# EAGLE design SMD_Latch_Switch_v01 (EAGLE 6.5.0)
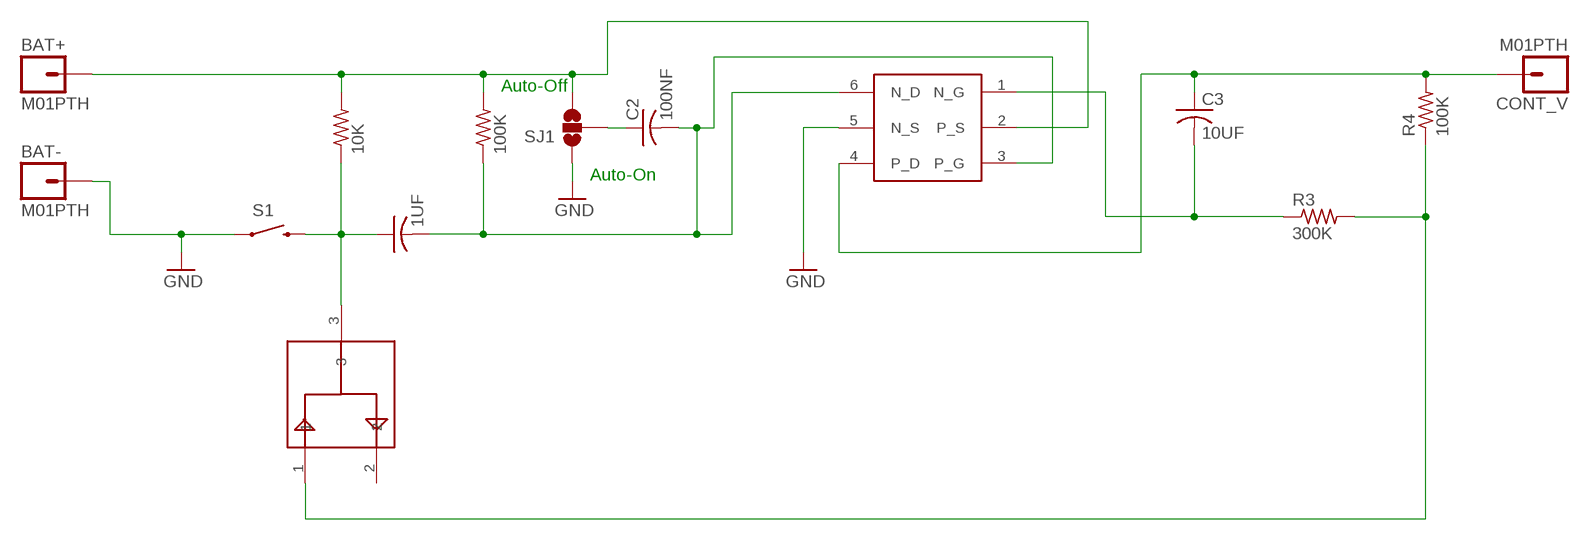
[diagram p0: schematic, sheet 1]

## Parts
1UF  1UF  C-USC0402  [C0402]
10K  10K  R-US_R0402  [R0402]
100K  100K  R-US_R0402  [R0402]
BAT+  M01PTH  [1X01]
BAT-  M01PTH  [1X01]
C2  100NF  C-USC0402  [C0402]
C3  10UF  C-USC0805  [C0805]
CONT_V  M01PTH  [1X01]
R3  300K  R-US_R0402  [R0402]
R4  100K  R-US_R0402  [R0402]
S1  SWITCH-MOMENTARY-2SMD  [TACTILE_SWITCH_SMD]
SJ1  SOLDERJUMPER_2WAYPASTE1&2  [SJ_3_PASTE1&2]
U$1  SI3588DV  [SOT23-6]
U$2  BAV99  [SOT23]

## Nets
GND: BAT-.1 S1.1 SJ1.1 U$1.5(N_S)
N$1: 10K.2 100K.2 BAT+.1 SJ1.3 U$1.2(P_S)
N$2: 1UF.1 10K.1 S1.3 U$2.3
N$3: C2.1 SJ1.2
N$4: 1UF.2 100K.1 C2.2 U$1.3(P_G) U$1.6(N_D)
N$5: R3.2 R4.1 U$2.1
N$6: C3.1 CONT_V.1 R4.2 U$1.4(P_D)
N$7: C3.2 R3.1 U$1.1(N_G)
Unconnected: U$2.2

## Notes on the sheet
- Auto-Off
- Auto-On

## Library data of the parts
1UF C2 C3 = resistor:C-US: CAPACITOR, American symbol
10K 100K R3 R4 = resistor:R-US_: RESISTOR, American symbol
BAT+ BAT- CONT_V = SparkFun-Connectors:M01: Header 1 Standard 1-pin 0.1" header. Use with straight break away headers (SKU : PRT-00116), right angle break away headers (PRT-00553), swiss pins (PRT-00743), machine pins (PRT-00117), and female headers (PRT-00115).
S1 = SparkFun-Electromechanical:SWITCH-MOMENTARY-2: Various NO switches- pushbuttons, reed, etc
SJ1 = SparkFun-Passives:SOLDERJUMPER_2WAY: Solder Jumper 2 way solder jumper
U$1 = adafruit:SI3588DV
U$2 = adafruit:BAV99

## Board
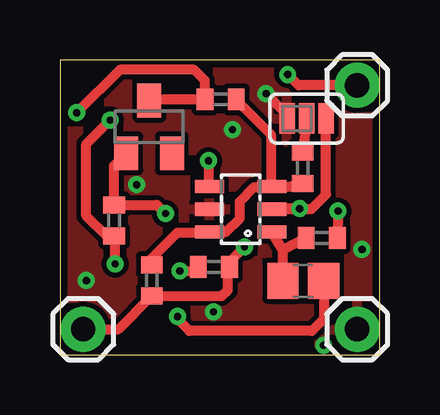
[diagram p1: board, top side]
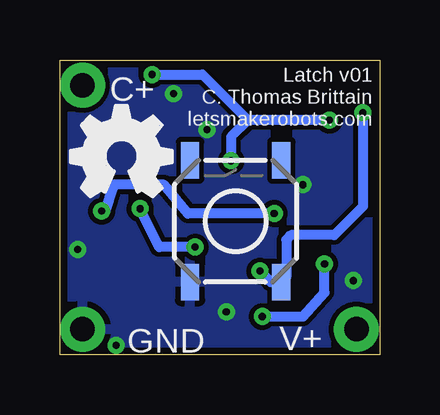
[diagram p2: board, bottom side, seen from below]

Size 13.34 x 12.29 mm. Coordinates in mm from the lower left corner, seen from the top.
Outline: 0,0 13.34,0 13.34,12.29 0,12.29 0,0
Copper layers (1*16): Top 0.035mm / dielectric 1.5mm / Bottom 0.035mm
Design rules "default *": minimum track width 10mil, minimum drill 24mil, track to track 8mil, track to pad 8mil, pad to pad 8mil, via to via 8mil, smd to smd 8mil, copper to edge 12mil, drill to drill 6mil, minimum pad ring 10mil, minimum via ring 8mil, stop-mask expansion 4mil, vias tented up to drill 0mil, thermal gap 10mil

### Footprints (pad centres in the part's own frame; a part is rotated, then mirrored left to right if it is on the bottom)
C0402 = smd 0.7 x 0.9: 1 -0.65,0; 2 0.65,0
R0402 = smd 0.7 x 0.9: 1 -0.65,0; 2 0.65,0
1X01 = drill 1.016 pad 1.88: 1 0,0
C0805 = smd 1.3 x 1.5: 1 -0.85,0; 2 0.85,0
TACTILE_SWITCH_SMD = smd 1.524 x 0.762: 1 -2.54,1.905; 2 2.54,1.905; 3 -2.54,-1.905; 4 2.54,-1.905
SJ_3_PASTE1&2 = smd 0.635 x 1.27: 1 -0.813,0; 2 0,0; 3 0.813,0
SOT23-6 = smd 0.55 x 1.2: 1 -0.95,-1.3; 2 0,-1.3; 3 0.95,-1.3; 4 0.95,1.3; 5 0,1.3; 6 -0.95,1.3
SOT23 = smd 1 x 1.4: 1 -0.95,-1.1; 2 0.95,-1.1; 3 0,1.1

### Placement (x,y rotation side)
1UF  6.7,10.66 0 top
10K  6.42,3.67 0 top
100K  3.83,3.11 270 top
BAT+  0.97,1.07 0 top
BAT-  12.4,1.07 0 top
C2  10.13,7.8 270 top
C3  10.15,3.09 180 top
CONT_V  12.4,11.25 0 top
R3  10.92,4.88 0 top
R4  2.26,5.61 270 top
S1  6.01,5.58 90 bottom
SJ1  10.29,9.86 0 top
U$1  7.54,6.08 90 top
U$2  3.72,9.51 0 top
U$3  [OSHW_FILLX150_NOTEXT]  12.9,6.6 0 bottom

### Tracks (layer width: path | path; a pad name or v marks a point on that pad's centre or on a via)
GND  (via drill 0.3)
  Top 0.406: SJ1.1 9.48,10.02 v8.6,10.9
  other vias: 7.2,9.4 6.4,1.8 1.1,3.1 11,0.4 12.6,4.4 3.2,7.1
  pour Bottom: -1.57,-0.2 -1.57,13.77 14.94,13.77 14.94,-1.47 -1.57,-1.47
  pour Top: -1.57,-0.2 -1.57,13.77 14.94,13.77 14.94,-1.47 -1.57,-1.47
N$1  (via drill 0.3)
  Top 0.406: BAT+.1 2.44,1.07 100K.2 6.76,2.46 7,2.7 7,3.6 10K.2 7.07,3.87 v7.7,4.5 | v10,6.1 8.86,6.1 U$1.2 10.48,6.08 11.1,6.7 11.1,9.56 SJ1.3
  Bottom 0.406: v7.7,4.5 9.2,4.5 v10,6.1
N$2  (via drill 0.3)
  Top 0.406: U$2.3 3.77,10.66 1UF.1 6.05,11.45 5.6,11.9 2.5,11.9 v0.7,10.1 | v5,3.5 5.6,3.5 10K.1
  Bottom 0.406: v5,3.5 4.54,3.04 S1.3 3.9,3.24 3.9,4.8 3.7,5 1.9,5 0.7,6.2 v0.7,10.1
N$3
  Top 0.406: C2.1 10.33,9.82 SJ1.2
N$4
  Top 0.406: 100K.1 3.83,4.03 4.9,5.1 6.21,5.1 U$1.6 6.93,5.13 7.5,5.7 7.5,6.4 8.1,7 8.81,7 U$1.3 | U$1.3 9.65,7.03 C2.2 | 1UF.2 8.8,9.2 8.8,7.07 U$1.3
N$5  (via drill 0.3)
  Top 0.406: U$2.1 2.26,7.9 R4.1 4.04,6.26 v4.4,5.9 | v11.6,6 11.59,5.9 R3.2
  Bottom 0.406: v4.4,5.9 8,5.9 9,7.1 11.1,7.1 11.5,5.9 v11.6,6
N$6  (via drill 0.3)
  Top 0.406: C3.1 11,1.5 10.5,1 5.4,1 4.9,1.5 v4.9,1.6 | v2.3,3.8 2.3,4.92 | 2.3,4.92 R4.2 | 2.3,4.92 1.98,4.92 1.1,5.8 1.1,8.8 v2.1,9.8 | v6.2,8.1 6.2,7.07 U$1.4 | CONT_V.1 9.95,11.25 v9.5,11.7
  Bottom 0.406: v4.9,1.6 3.2,1.6 2.3,2.6 v2.3,3.8 | v2.1,9.8 5.5,9.8 | 5.5,9.8 6.2,9.1 v6.2,8.1 | v9.5,11.7 7.4,11.7 5.5,9.8
N$7
  Top 0.406: C3.2 9.3,4.37 | R3.1 9.3,4.37 | 9.3,4.37 U$1.1

### Text on the board
_tsilk: BV99 | 1uF | 100nF | 300k | 100k | SI3588DV | 10k | 100k | 10uF
_bsilk: Latch v01 / C. Thomas Brittain / letsmakerobots.com | C+ | V+ | GND